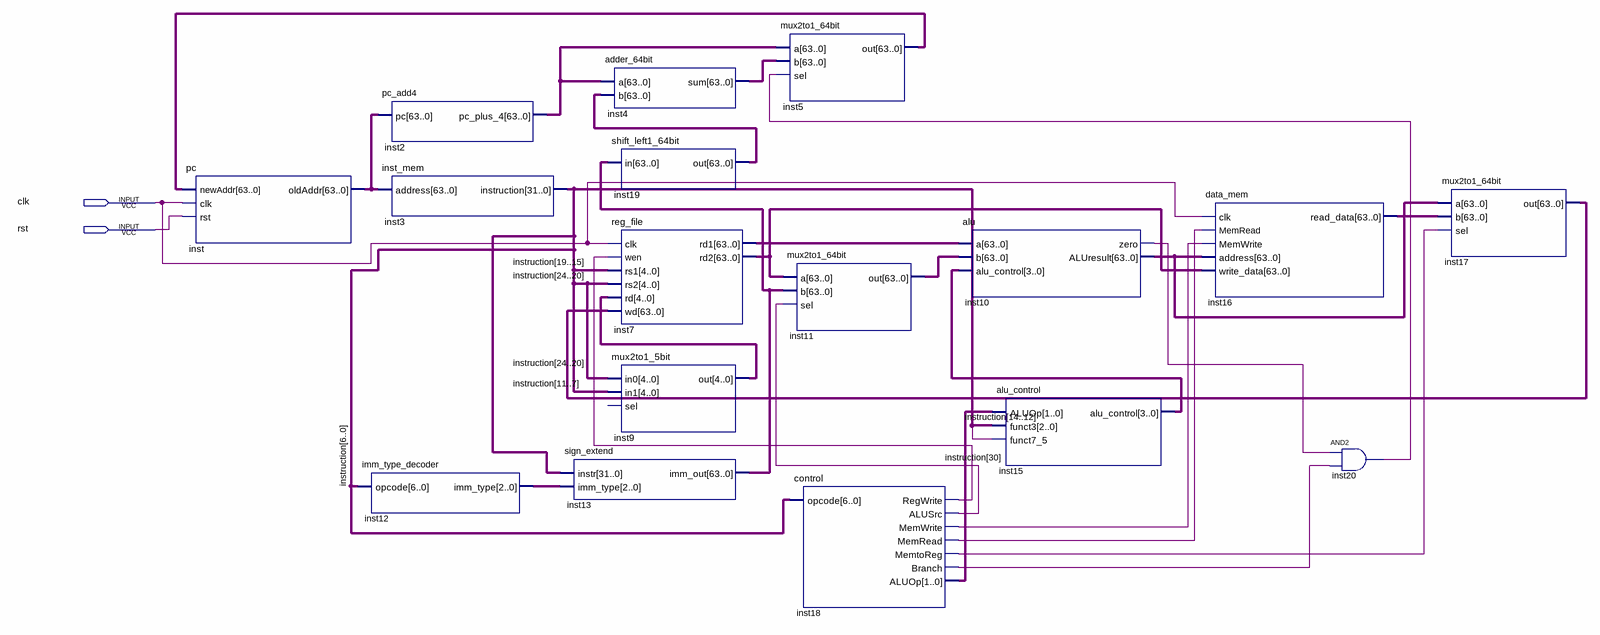
[diagram p0: schematic sheet]
// Quartus schematic cpu.bdf as structural Verilog: 17 symbols, 2 pins
module cpu (
  input  clk,
  input  rst
);

  wire inst10_zero, inst18_alusrc, inst18_branch, inst18_memread, inst18_memtoreg, inst18_memwrite,
       inst18_regwrite, inst20_out;
  wire [1:0] inst18_aluop;
  wire [2:0] inst12_imm_type;
  wire [3:0] inst15_alu_control;
  wire [4:0] inst9_out;
  wire [30:0] instruction;
  wire [63:0] inst2_pc_plus_4, inst4_sum, inst5_out, inst7_rd1, inst7_rd2, inst10_aluresult, inst11_out,
       inst13_imm_out, inst16_read_data, inst17_out, inst19_out, inst_oldaddr;

  pc inst (.newAddr(inst5_out), .clk(clk), .rst(rst), .oldAddr(inst_oldaddr));
  pc_add4 inst2 (.pc(inst_oldaddr), .pc_plus_4(inst2_pc_plus_4));
  inst_mem inst3 (.address(inst_oldaddr), .instruction(instruction[24:0]));
  imm_type_decoder inst12 (.opcode(instruction[24:0]), .imm_type(inst12_imm_type));
  sign_extend inst13 (.instr(instruction[24:0]), .imm_type(inst12_imm_type), .imm_out(inst13_imm_out));
  adder_64bit inst4 (.a(inst2_pc_plus_4), .b(inst19_out), .sum(inst4_sum));
  shift_left1_64bit inst19 (.in(inst13_imm_out), .out(inst19_out));
  reg_file inst7 (
    .clk(clk), .wen(inst18_regwrite), .rs1(instruction[19:15]), .rs2(instruction[24:20]), .rd(inst9_out),
    .wd(inst17_out), .rd1(inst7_rd1), .rd2(inst7_rd2));
  mux2to1_5bit inst9 (.in0(instruction[24:20]), .in1(instruction[11:7]), .out(inst9_out));  // open: sel
  mux2to1_64bit inst5 (.a(inst2_pc_plus_4), .b(inst4_sum), .sel(inst20_out), .out(inst5_out));
  mux2to1_64bit inst11 (.a(inst7_rd2), .b(inst13_imm_out), .sel(inst18_alusrc), .out(inst11_out));
  control inst18 (
    .opcode(instruction[24:0]), .RegWrite(inst18_regwrite), .ALUSrc(inst18_alusrc),
    .MemWrite(inst18_memwrite), .MemRead(inst18_memread), .MemtoReg(inst18_memtoreg), .Branch(inst18_branch),
    .ALUOp(inst18_aluop));
  alu inst10 (
    .a(inst7_rd1), .b(inst11_out), .alu_control(inst15_alu_control), .zero(inst10_zero),
    .ALUresult(inst10_aluresult));
  alu_control inst15 (
    .ALUOp(inst18_aluop), .funct3(instruction[14:12]), .funct7_5(instruction[30]),
    .alu_control(inst15_alu_control));
  data_mem inst16 (
    .clk(clk), .MemRead(inst18_memread), .MemWrite(inst18_memwrite), .address(inst10_aluresult),
    .write_data(inst7_rd2), .read_data(inst16_read_data));
  and inst20 (inst20_out, inst10_zero, inst18_branch);
  mux2to1_64bit inst17 (.a(inst10_aluresult), .b(inst16_read_data), .sel(inst18_memtoreg), .out(inst17_out));
endmodule
